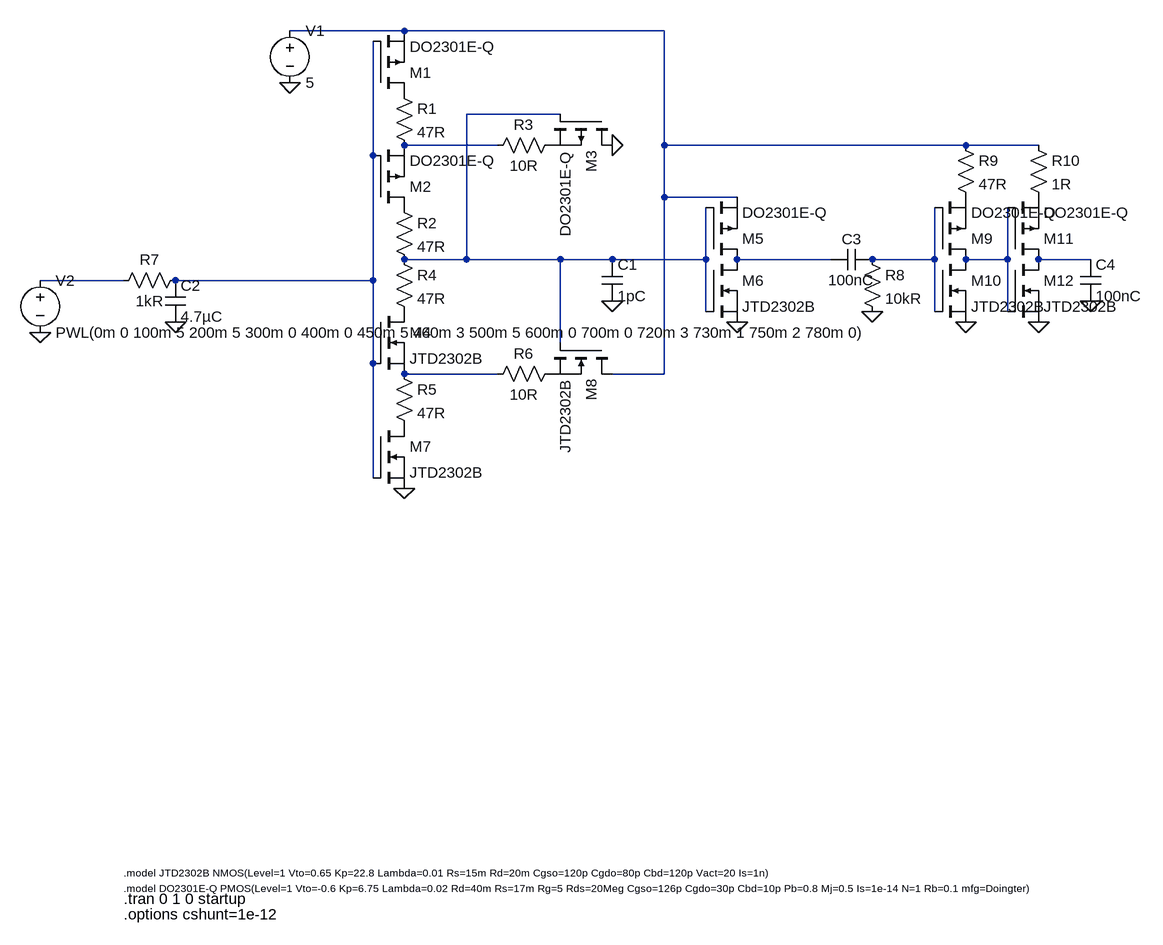
[diagram p0: schematic schmitt_trigger.asc]
schmitt_trigger.asc, the LTspice schematic file:
Version 4.1
SHEET 1 1856 680
WIRE 16 -1024 -160 -1024
WIRE 416 -1024 16 -1024
WIRE 256 -896 112 -896
WIRE 160 -848 16 -848
WIRE 416 -848 416 -1024
WIRE 880 -848 416 -848
WIRE 992 -848 880 -848
WIRE -32 -832 -32 -1008
WIRE 416 -768 416 -848
WIRE 528 -768 416 -768
WIRE 112 -672 112 -896
WIRE 112 -672 16 -672
WIRE 256 -672 112 -672
WIRE 336 -672 256 -672
WIRE 480 -672 480 -752
WIRE 480 -672 336 -672
WIRE 672 -672 528 -672
WIRE 832 -672 832 -752
WIRE 832 -672 736 -672
WIRE 944 -672 944 -752
WIRE 944 -672 880 -672
WIRE 1072 -672 992 -672
WIRE -416 -640 -544 -640
WIRE -32 -640 -32 -832
WIRE -32 -640 -336 -640
WIRE 480 -592 480 -672
WIRE 832 -592 832 -672
WIRE 944 -592 944 -672
WIRE 256 -544 256 -672
WIRE -32 -512 -32 -640
WIRE 160 -496 16 -496
WIRE 416 -496 416 -768
WIRE 416 -496 336 -496
WIRE -32 -336 -32 -512
FLAG -160 -944 0
FLAG 528 -576 0
FLAG -544 -560 0
FLAG 336 -848 0
FLAG 16 -320 0
FLAG 336 -608 0
FLAG -336 -576 0
FLAG 736 -592 0
FLAG 880 -576 0
FLAG 992 -576 0
FLAG 1072 -608 0
SYMBOL voltage -160 -1040 R0
WINDOW 123 0 0 Left 0
WINDOW 39 0 0 Left 0
SYMATTR InstName V1
SYMATTR Value 5
SYMBOL pmos 480 -672 M180
SYMATTR InstName M5
SYMATTR Value DO2301E-Q
SYMBOL nmos 480 -672 R0
SYMATTR InstName M6
SYMATTR Value JTD2302B
SYMBOL voltage -544 -656 R0
WINDOW 123 0 0 Left 0
WINDOW 39 0 0 Left 0
SYMATTR InstName V2
SYMATTR Value PWL(0m 0 100m 5 200m 5 300m 0 400m 0 450m 5 460m 3 500m 5 600m 0 700m 0 720m 3 730m 1 750m 2 780m 0)
SYMBOL pmos -32 -928 M180
SYMATTR InstName M1
SYMATTR Value DO2301E-Q
SYMBOL res 0 -944 R0
SYMATTR InstName R1
SYMATTR Value 47R
SYMBOL pmos -32 -752 M180
SYMATTR InstName M2
SYMATTR Value DO2301E-Q
SYMBOL res 0 -768 R0
SYMATTR InstName R2
SYMATTR Value 47R
SYMBOL pmos 336 -896 R90
SYMATTR InstName M3
SYMATTR Value DO2301E-Q
SYMBOL res 256 -864 R90
WINDOW 0 0 56 VBottom 2
WINDOW 3 32 56 VTop 2
SYMATTR InstName R3
SYMATTR Value 10R
SYMBOL res 0 -688 R0
SYMATTR InstName R4
SYMATTR Value 47R
SYMBOL nmos -32 -592 R0
SYMATTR InstName M4
SYMATTR Value JTD2302B
SYMBOL res 0 -512 R0
SYMATTR InstName R5
SYMATTR Value 47R
SYMBOL nmos -32 -416 R0
SYMATTR InstName M7
SYMATTR Value JTD2302B
SYMBOL nmos 336 -544 R90
SYMATTR InstName M8
SYMATTR Value JTD2302B
SYMBOL res 256 -512 R90
WINDOW 0 0 56 VBottom 2
WINDOW 3 32 56 VTop 2
SYMATTR InstName R6
SYMATTR Value 10R
SYMBOL cap 320 -672 R0
SYMATTR InstName C1
SYMATTR Value 1pC
SYMBOL res -320 -656 R90
WINDOW 0 0 56 VBottom 2
WINDOW 3 32 56 VTop 2
SYMATTR InstName R7
SYMATTR Value 1kR
SYMBOL cap -352 -640 R0
SYMATTR InstName C2
SYMATTR Value 4.7µC
SYMBOL cap 736 -688 R90
WINDOW 0 0 32 VBottom 2
WINDOW 3 32 32 VTop 2
SYMATTR InstName C3
SYMATTR Value 100nC
SYMBOL res 720 -688 R0
SYMATTR InstName R8
SYMATTR Value 10kR
SYMBOL pmos 832 -672 M180
SYMATTR InstName M9
SYMATTR Value DO2301E-Q
SYMBOL nmos 832 -672 R0
SYMATTR InstName M10
SYMATTR Value JTD2302B
SYMBOL pmos 944 -672 M180
SYMATTR InstName M11
SYMATTR Value DO2301E-Q
SYMBOL nmos 944 -672 R0
SYMATTR InstName M12
SYMATTR Value JTD2302B
SYMBOL res 864 -864 R0
SYMATTR InstName R9
SYMATTR Value 47R
SYMBOL res 976 -864 R0
SYMATTR InstName R10
SYMATTR Value 1R
SYMBOL cap 1056 -672 R0
SYMATTR InstName C4
SYMATTR Value 100nC
TEXT -416 272 Left 1 !.model JTD2302B NMOS(Level=1 Vto=0.65 Kp=22.8 Lambda=0.01 Rs=15m Rd=20m Cgso=120p Cgdo=80p Cbd=120p Vact=20 Is=1n)
TEXT -416 296 Left 1 !.model DO2301E-Q PMOS(Level=1 Vto=-0.6 Kp=6.75 Lambda=0.02 Rd=40m Rs=17m Rg=5 Rds=20Meg Cgso=126p Cgdo=30p Cbd=10p Pb=0.8 Mj=0.5 Is=1e-14 N=1 Rb=0.1 mfg=Doingter)
TEXT -416 312 Left 2 !.tran 0 1 0 startup
TEXT -416 336 Left 2 !.options cshunt=1e-12

The netlist it stands for:
* schmitt_trigger.asc
V1 N001 0 5
M5 N005 N002 N001 N001 DO2301E-Q
M6 N005 N002 0 0 JTD2302B
V2 N009 0 PWL(0m 0 100m 5 200m 5 300m 0 400m 0 450m 5 460m 3 500m 5 600m 0 700m 0 720m 3 730m 1 750m 2 780m 0)
M1 P001 N004 N001 N001 DO2301E-Q
R1 P001 N003 47R
M2 P002 N004 N003 N003 DO2301E-Q
R2 P002 N002 47R
M3 0 N002 P003 P003 DO2301E-Q
R3 P003 N003 10R
R4 N002 P004 47R
M4 P004 N004 N010 N010 JTD2302B
R5 N010 P005 47R
M7 P005 N004 0 0 JTD2302B
M8 N001 N002 P006 P006 JTD2302B
R6 P006 N010 10R
C1 N002 0 1pC
R7 N004 N009 1kR
C2 N004 0 4.7µC
C3 N006 N005 100nC
R8 N006 0 10kR
M9 N007 N006 P007 P007 DO2301E-Q
M10 N007 N006 0 0 JTD2302B
M11 N008 N007 P008 P008 DO2301E-Q
M12 N008 N007 0 0 JTD2302B
R9 N001 P007 47R
R10 N001 P008 1R
C4 N008 0 100nC
.model NMOS NMOS
.model PMOS PMOS
.lib standard.mos
.model JTD2302B NMOS(Level=1 Vto=0.65 Kp=22.8 Lambda=0.01 Rs=15m Rd=20m Cgso=120p Cgdo=80p Cbd=120p Vact=20 Is=1n)
.model DO2301E-Q PMOS(Level=1 Vto=-0.6 Kp=6.75 Lambda=0.02 Rd=40m Rs=17m Rg=5 Rds=20Meg Cgso=126p Cgdo=30p Cbd=10p Pb=0.8 Mj=0.5 Is=1e-14 N=1 Rb=0.1 mfg=Doingter)
.tran 0 1 0 startup
.options cshunt=1e-12
.backanno
.end